# Altium schematic sheet Title Page.SchDoc
size 431 x 279 mm; SheetNumber: 1; SheetTotal: 1
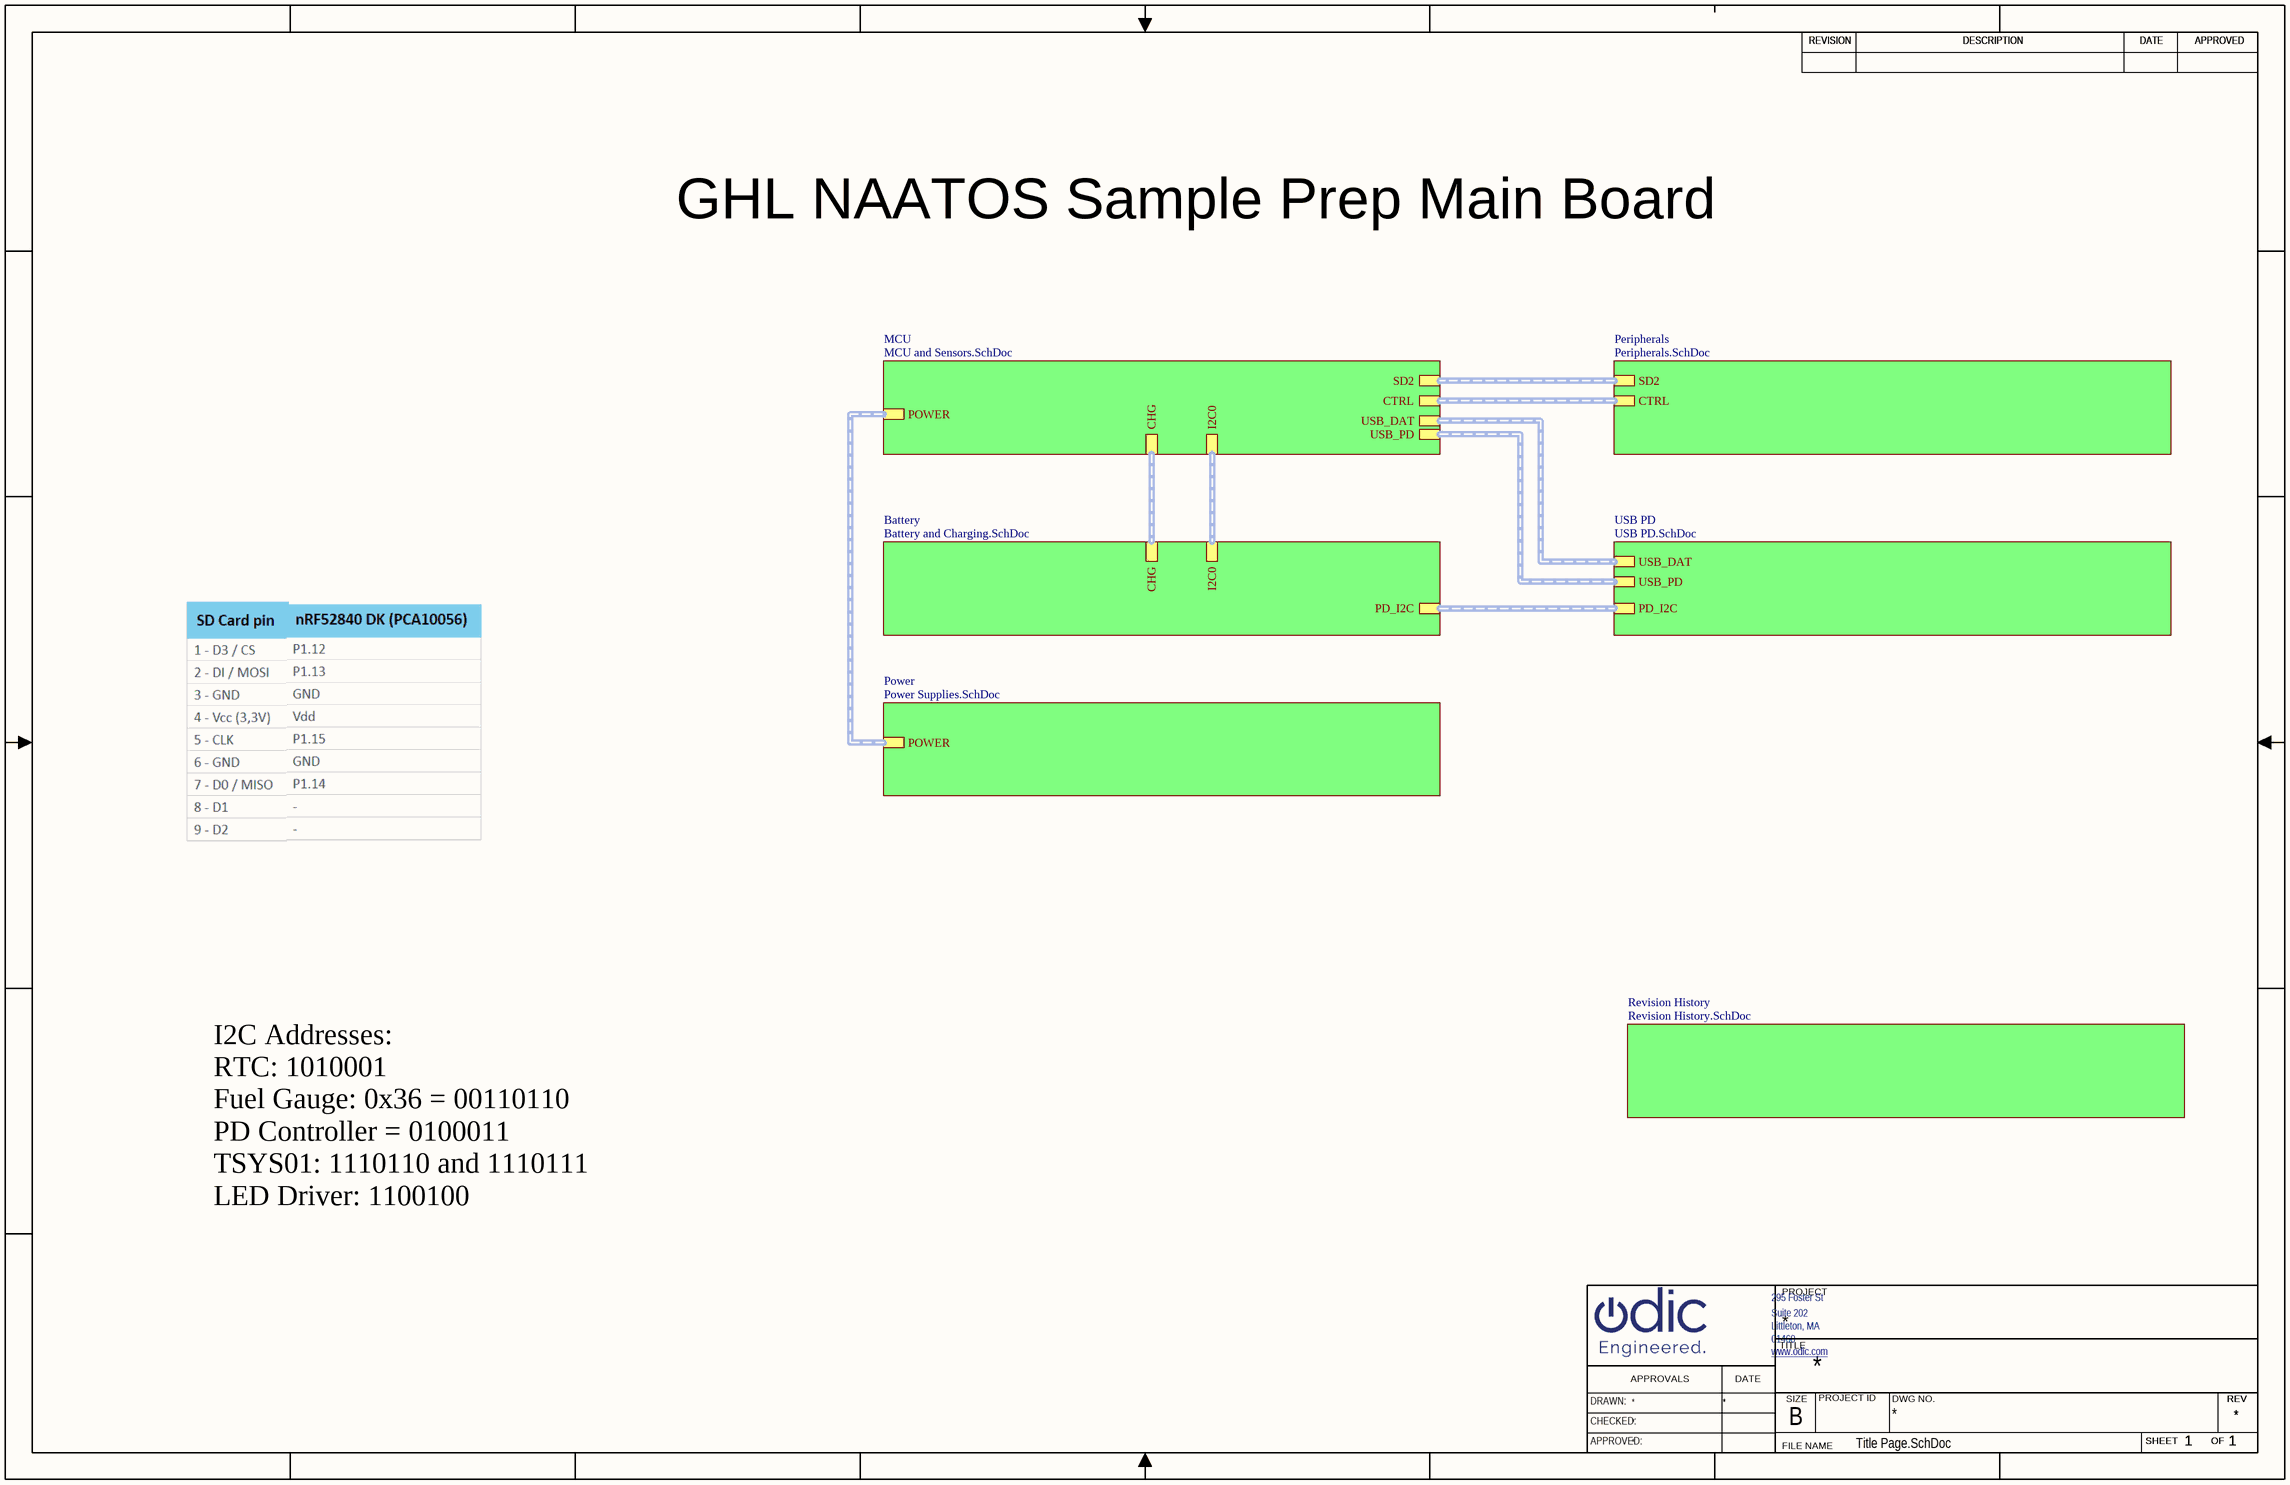
[diagram p0: Title Page.SchDoc]

## Sub-sheets
Battery = Battery and Charging.SchDoc: CHG, I2C0, PD_I2C
MCU = MCU and Sensors.SchDoc: CHG, CTRL, POWER, USB_PD, SD2, USB_DAT, I2C0
Peripherals = Peripherals.SchDoc: CTRL, SD2
Power = Power Supplies.SchDoc: POWER
Revision History = Revision History.SchDoc: no entries
USB PD = USB PD.SchDoc: USB_PD, PD_I2C, USB_DAT

## Buses and harness runs
harness sheet Battery/CHG = sheet MCU/CHG
harness sheet Battery/I2C0 = sheet MCU/I2C0
harness sheet Battery/PD_I2C = sheet USB PD/PD_I2C
harness sheet MCU/CTRL = sheet Peripherals/CTRL
harness sheet MCU/POWER = sheet Power/POWER
harness sheet MCU/SD2 = sheet Peripherals/SD2
harness sheet MCU/USB_DAT = sheet USB PD/USB_DAT
harness sheet MCU/USB_PD = sheet USB PD/USB_PD

## Notes on the sheet
- GHL NAATOS Sample Prep Main Board
- I2C Addresses:
  RTC: 1010001
  Fuel Gauge: 0x36 = 00110110
  PD Controller = 0100011
  TSYS01: 1110110 and 1110111
  LED Driver: 1100100
- REVISION
- DESCRIPTION
- DATE
- APPROVED
- 295 Foster St
- PROJECT
- www.odic.com <http://www.odic.com>
- Littleton, MA
- 01460
- Suite 202
- TITLE
- DRAWN:
- CHECKED:
- APPROVALS
- SIZE
- B
- PROJECT ID
- DWG NO.
- SHEET
- OF
- REV
- APPROVED:
- FILE NAME